# EAGLE design OpenProg-18F2550-etch (EAGLE 7.2.0)
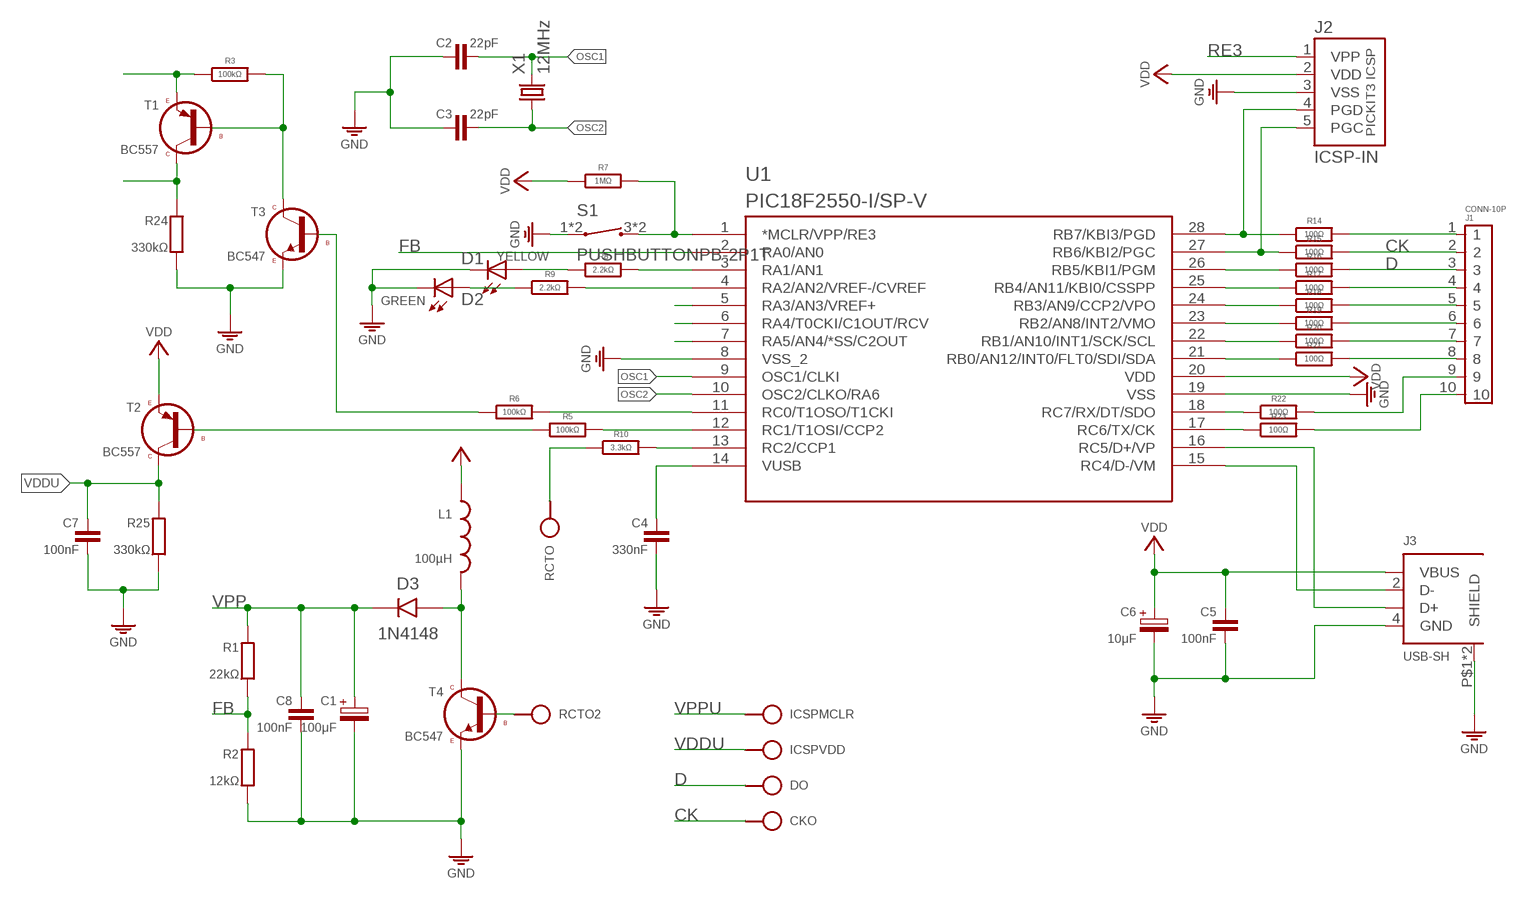
[diagram p0: schematic, sheet 1]

## Parts
C1  100μF  CPOLE2,5-5/V  [E2,5-5/V]
C2  22pF  C-H025-015X024  [C025-015X024]
C3  22pF  C-H025-015X024  [C025-015X024]
C4  330nF  C050-030X075  [C050-030X075]
C5  100nF  C025-015X024  [C025-015X024]
C6  10μF  CPOLE2.5-5  [E2,5-5]
C7  100nF  C025-015X024  [C025-015X024]
C8  100nF  C025-015X024  [C025-015X024]
CKO  HPORT  [SPAD]
D1  YELLOW  LED-3MM  [LED_3MM]
D2  GREEN  LED-3MM  [LED_3MM]
D3  1N4148  1N4148-HDO34-7  [DO34-7]
DO  HPORT  [SPAD]
ICSPMCLR  HPORT  [SPAD]
ICSPVDD  HPORT  [SPAD]
J1  CONN-10P  [CONN-10P]
J2  ICSP-IN  PICKIT3-ICSP-PK3  [PIC-PK3]
J3  USB-SH  [USB-B-PRINT]
L1  100µH  L02/10  [L-03/10V]
R1  22kΩ  R0204/10-V  [0204/10-V]
R2  12kΩ  R0204/10-V  [0204/10-V]
R3  100kΩ  R-H0204/2  [0204/2]
R5  100kΩ  R-H0204/10  [0204/10]
R6  100kΩ  R-H0204/10  [0204/10]
R7  1MΩ  R-H0204/10-V  [0204/10-V]
R8  2.2kΩ  R-H0204/10  [0204/10]
R9  2.2kΩ  R-H0204/10  [0204/10]
R10  3.3kΩ  R-H0204/10  [0204/10]
R14  100Ω  R-H0204/10  [0204/10]
R15  100Ω  R-H0204/10  [0204/10]
R16  100Ω  R-H0204/10  [0204/10]
R17  100Ω  R-H0204/10  [0204/10]
R18  100Ω  R-H0204/10  [0204/10]
R19  100Ω  R-H0204/10  [0204/10]
R20  100Ω  R-H0204/10  [0204/10]
R21  100Ω  R-H0204/10  [0204/10]
R22  100Ω  R-H0204/10  [0204/10]
R23  100Ω  R-H0204/10  [0204/10]
R24  330kΩ  R0204/10-V  [0204/10-V]
R25  330kΩ  R0204/10-V  [0204/10-V]
RCTO  HPORT  [SPAD]
RCTO2  HPORT  [SPAD]
S1  PUSHBUTTONPB-2P1T  [PB-2P1T]
T1  BC557  BC557CBE  [TO92-CBE]
T2  BC557  BC557CBE  [TO92-CBE]
T3  BC547  [TO92]
T4  BC547  [TO92]
U1  PIC18F2550-I/SP-V  [DIL28-3/V]
X1  12MHz  CRYSTALHC49  [HC49]

## Nets
CK: CKO.1 J1.2 R15.2
D: DO.1 J1.3 R16.2
FB: R1.2 R2.1 U1.2(RA0/AN0)
GND: C1.- C2.1 C3.1 C4.2 C5.2 C6.- C7.2 C8.2 D1.K(C) D2.K(C) J2.3(VSS) J3.4(GND) J3.P$1(SHIELD) J3.P$2(SHIELD) R2.2 R24.2 R25.2 S1.1 S1.2 T3.3(E) T4.3(E) U1.8(VSS_2) U1.19(VSS)
N$1: R5.1 T2.2(B)
N$3: U1.5(RA3/AN3/VREF+)
N$4: U1.6(RA4/T0CKI/C1OUT/RCV)
N$5: D3.A L1.2 T4.1(C)
N$6: U1.7(RA5/AN4/*SS/C2OUT)
N$8: R10.1 RCTO.1
N$11: R3.2 T1.2(B) T3.1(C)
N$13: J2.4(PGD) R14.1 U1.28(RB7/KBI3/PGD)
N$15: J2.5(PGC) R15.1 U1.27(RB6/KBI2/PGC)
N$16: R16.1 U1.26(RB5/KBI1/PGM)
N$17: R17.1 U1.25(RB4/AN11/KBI0/CSSPP)
N$18: R18.1 U1.24(RB3/AN9/CCP2/VPO)
N$19: R19.1 U1.23(RB2/AN8/INT2/VMO)
N$20: R20.1 U1.22(RB1/AN10/INT1/SCK/SCL)
N$21: R21.1 U1.21(RB0/AN12/INT0/FLT0/SDI/SDA)
N$22: J1.1 R14.2
N$25: J1.4 R17.2
N$26: J1.5 R18.2
N$27: J1.6 R19.2
N$28: J1.7 R20.2
N$30: R22.1 U1.18(RC7/RX/DT/SDO)
N$31: R23.1 U1.17(RC6/TX/CK)
N$32: J1.9 R22.2
N$33: J1.10 R23.2
N$34: J3.3(D+) U1.16(RC5/D+/VP)
N$36: C4.1 U1.14(VUSB)
N$39: D1.A R8.1
N$40: D2.A R9.1
OSC1: C2.2 U1.9(OSC1/CLKI) X1.2
OSC2: C3.2 U1.10(OSC2/CLKO/RA6) X1.1
RA1: R8.2 U1.3(RA1/AN1)
RA2: R9.2 U1.4(RA2/AN2/VREF-/CVREF)
RC0: R6.2 U1.11(RC0/T1OSO/T1CKI)
RC1: R5.2 U1.12(RC1/T1OSI/CCP2)
RC2: R10.2 U1.13(RC2/CCP1)
RE3: J2.1(VPP) R7.2 S1.3 S1.4 U1.1(*MCLR/VPP/RE3)
VCC: C5.1 C6.+ J2.2(VDD) J3.1(VBUS) L1.1 R7.1 T2.3(E) U1.20(VDD) ; supply symbol labelled VDD
VDD1: J1.8 R21.2
VDD3: J3.2(D-) U1.15(RC4/D-/VM)
VDDU: C7.1 ICSPVDD.1 R25.1 T2.1(C)
VPP: C1.+ C8.1 D3.C R1.1 R3.1 T1.3(E)
VPPCTL: R6.1 T3.2(B)
VPPU: ICSPMCLR.1 R24.1 T1.1(C)
VREGCTL: RCTO2.1 T4.2(B)

## Library data of the parts
C1 C6 = c:CPOL: POLARIZED CAPACITOR, European symbol
C2 C3 = c:C-H
C4 C5 C7 C8 = c:C: CAPACITOR, European symbol
CKO DO ICSPMCLR ICSPVDD RCTO RCTO2 = pad:HPORT: Conrad Connectors Created by librarian@cadsoft.de
D1 D2 = d:LED
D3 = d:1N4148-H
J1 = pinconn:CONN-10P
J2 = pinconn:PICKIT3-ICSP
J3 = usb:USB-SH
L1 = l:L: Potentiometers Beckman, Copal, Piher, Spectrol, Schukat Created by librarian@cadsoft.de
R1 R2 R24 R25 = r:R: RESISTOR, European symbol
R3 R5-R10 R14-R23 = r:R-H
S1 = sw:PUSHBUTTON
T1 T2 = t:BC557
T3 T4 = t:BC547
U1 = mcu:PIC18F2550-I/SP
X1 = q:CRYSTAL

## Net classes
0 default: width 0.406 mm

## Board
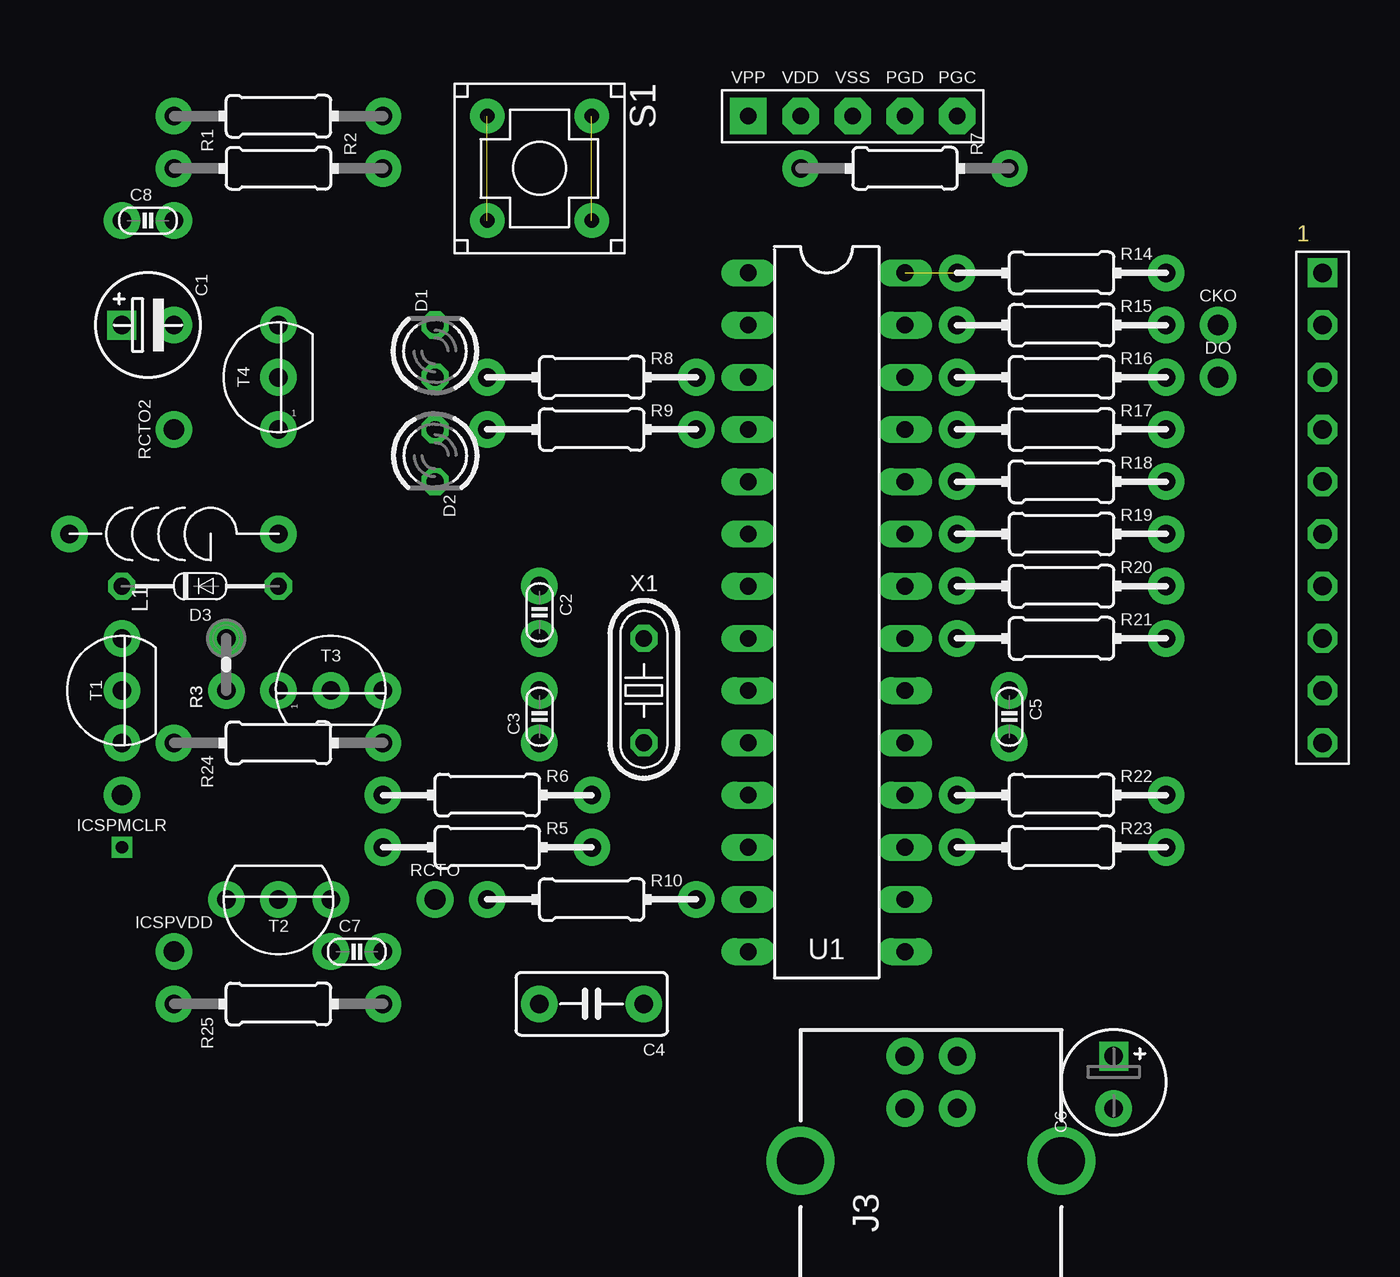
[diagram p1: board, top side]
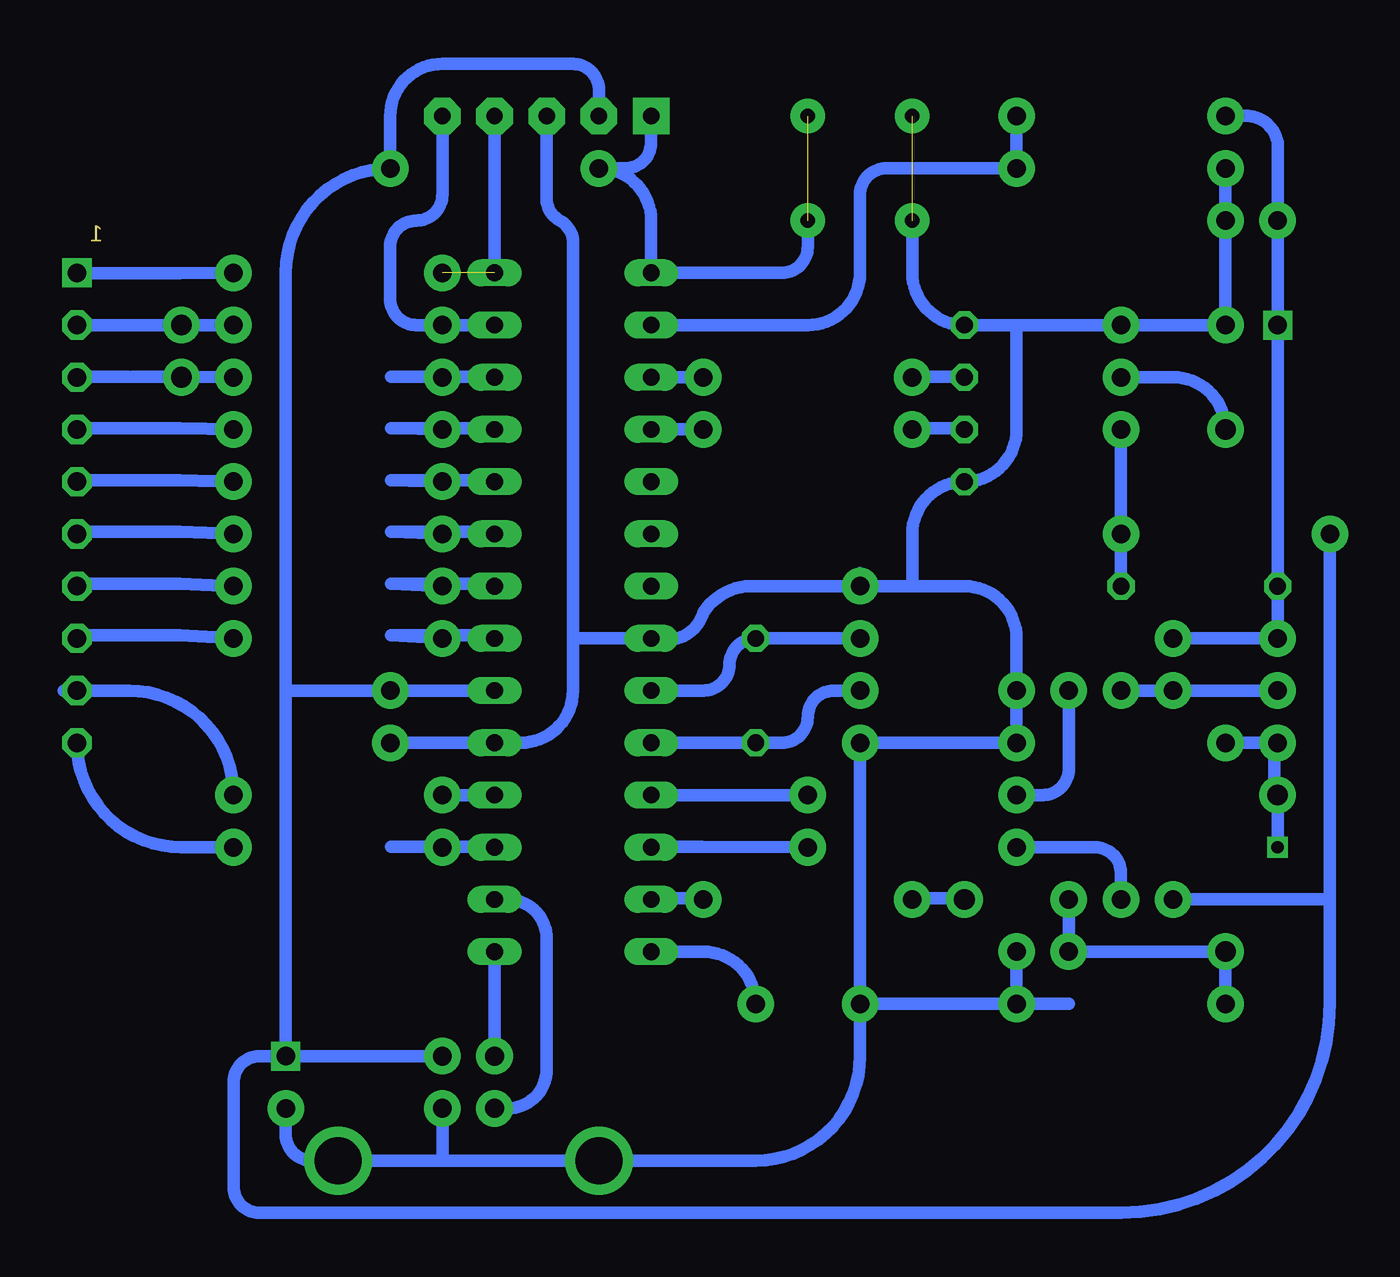
[diagram p2: board, bottom side, seen from below]

No outline drawn. Coordinates in mm, seen from the top.
Copper layers (1*16): Top 0.035mm / dielectric 1.5mm / Bottom 0.035mm
Design rules "default": minimum track width 10mil, minimum drill 24mil, track to track 8mil, track to pad 8mil, pad to pad 8mil, via to via 8mil, smd to smd 8mil, copper to edge 40mil, drill to drill 8mil, minimum pad ring 10mil, minimum via ring 8mil, stop-mask expansion 4mil, vias tented up to drill 0mil, thermal gap 10mil

### Footprints (pad centres in the part's own frame; a part is rotated, then mirrored left to right if it is on the bottom)
E2,5-5/V = drill 0.9 square: + 0,-1.27 | drill 0.9 pad 1.778: - 0,1.27
C025-015X024 = drill 0.9 pad 1.778: 1 -1.27,0; 2 1.27,0
C050-030X075 = drill 0.9 pad 1.778: 1 -2.54,0; 2 2.54,0
E2,5-5 = drill 0.9 square: + 1.27,0 | drill 0.9 pad 1.778: - -1.27,0
SPAD = drill 1 pad 1.778: 1 0,0
LED_3MM = drill 0.813 octagon: A -1.27,0; K 1.27,0
DO34-7 = drill 0.813 octagon: A -3.81,0; C 3.81,0
CONN-10P = drill 0.9 pad 1.422 square: 1 -10.16,0 | drill 0.9 pad 1.422 octagon: 2 -7.62,0; 3 -5.08,0; 4 -2.54,0; 5 0,0; 6 2.54,0; 7 5.08,0; 8 7.62,0; 9 10.16,0; 10 12.7,0
PIC-PK3 = drill 0.8 pad 1.778 square: 1 -5.08,0 | drill 0.8 pad 1.778 octagon: 2 -2.54,0; 3 0,0; 4 2.54,0; 5 5.08,0
USB-B-PRINT = drill 0.914 pad 1.778: 1 0,6.35; 2 -2.54,6.35; 3 -2.54,3.81; 4 0,3.81 | drill 2.286: P$1 5.08,1.27; P$2 -7.62,1.27
L-03/10V = drill 0.9 pad 1.778: 1 0,5.08; 2 0,-5.08
0204/10-V = drill 0.9 pad 1.778: 1 0,5.08; 2 0,-5.08
0204/2 = drill 0.9 pad 1.778: 1 1.27,0; 2 -1.27,0
0204/10 = drill 0.9 pad 1.778: 1 -5.08,0; 2 5.08,0
PB-2P1T = drill 0.7 pad 1.676: 1 2.54,-2.54; 2 -2.54,-2.54; 3 2.54,2.54; 4 -2.54,2.54
TO92-CBE = drill 0.9 pad 1.778: 1 0,2.54; 2 0,0; 3 0,-2.54
TO92 = drill 0.9 pad 1.778: 1 0,2.54; 2 0,0; 3 0,-2.54
DIL28-3/V = drill 0.813 long: 1 -3.81,16.51; 2 -3.81,13.97; 3 -3.81,11.43; 4 -3.81,8.89; 5 -3.81,6.35; 6 -3.81,3.81; 7 -3.81,1.27; 8 -3.81,-1.27; 9 -3.81,-3.81; 10 -3.81,-6.35; 11 -3.81,-8.89; 12 -3.81,-11.43; 13 -3.81,-13.97; 14 -3.81,-16.51; 15 3.81,-16.51; 16 3.81,-13.97; 17 3.81,-11.43; 18 3.81,-8.89; 19 3.81,-6.35; 20 3.81,-3.81; 21 3.81,-1.27; 22 3.81,1.27; 23 3.81,3.81; 24 3.81,6.35; 25 3.81,8.89; 26 3.81,11.43; 27 3.81,13.97; 28 3.81,16.51
HC49 = drill 0.813 octagon: 1 0,-2.54; 2 0,2.54

### Placement (x,y rotation side)
C1  8.89,45.72 270 top
C2  27.94,31.75 270 top
C3  27.94,26.67 90 top
C4  30.48,12.7 180 top
C5  50.8,26.67 270 top
C6  55.88,8.89 90 top
C7  19.05,15.24 0 top
C8  8.89,50.8 0 top
CKO  60.96,45.72 270 top
D1  22.86,44.45 90 top
D2  22.86,39.37 270 top
D3  11.43,33.02 180 top
DO  60.96,43.18 270 top
ICSPMCLR  7.62,22.86 90 top
ICSPVDD  10.16,15.24 270 top
J1  66.04,38.1 270 top
J2  43.18,55.88 0 top
J3  48.26,3.81 0 top
L1  10.16,35.56 90 top
R1  15.24,55.88 90 top
R2  15.24,53.34 270 top
R3  12.7,29.21 90 top
R5  25.4,20.32 0 top
R6  25.4,22.86 0 top
R7  45.72,53.34 270 top
R8  30.48,43.18 0 top
R9  30.48,40.64 0 top
R10  30.48,17.78 0 top
R14  53.34,48.26 0 top
R15  53.34,45.72 0 top
R16  53.34,43.18 0 top
R17  53.34,40.64 0 top
R18  53.34,38.1 0 top
R19  53.34,35.56 0 top
R20  53.34,33.02 0 top
R21  53.34,30.48 0 top
R22  53.34,22.86 0 top
R23  53.34,20.32 0 top
R24  15.24,25.4 90 top
R25  15.24,12.7 90 top
RCTO  22.86,17.78 270 top
RCTO2  10.16,40.64 0 top
S1  27.94,53.34 270 top
T1  7.62,27.94 180 top
T2  15.24,17.78 270 top
T3  17.78,27.94 90 top
T4  15.24,43.18 180 top
U1  41.91,31.75 0 top
X1  33.02,27.94 0 top

### Tracks (layer width: path | path; a pad name or v marks a point on that pad's centre or on a via)
CK
  Bottom 0.61: J1.2 CKO.1 R15.2
D
  Bottom 0.61: J1.3 65.84,43.2 63.55,43.2 DO.1 63.32,43.2 61.04,43.2 R16.2
FB
  Bottom 0.61: R2.1 R1.2 20.32,53.98 arc90 20.95,53.34 26.67,53.34 arc-90 27.94,52.07 27.94,48.26 arc90 30.48,45.72 U1.2
GND  (1 unrouted)
  Bottom 0.61: C5.2 U1.19 44.45,25.4 arc-90 41.91,27.94 41.91,30.48 | 41.91,30.48 U1.8 36.83,30.48 arc-60 35.56,31.75 arc60 33.02,33.02 28.57,33.02 | 41.91,30.48 41.91,49.53 arc-70 42.55,50.8 arc70 43.18,52.07 J2.3 | 48.26,5.08 J3.P$1 54.61,5.08 arc90 55.88,6.35 C6.- | 48.26,5.08 J3.4 | 28.57,33.02 C2.1 25.4,33.02 | C4.2 C3.1 R24.2 T3.3 20.32,30.48 arc-90 22.86,33.02 25.4,33.02 | R25.2 C7.2 | C8.2 C1.- | C1.- R2.2 | C1.- T4.3 20.32,45.72 | C4.2 R25.2 | R25.2 17.78,12.7 | C4.2 27.94,10.16 arc90 33.02,5.08 J3.P$2 48.26,5.08 | 27.94,33.66 arc90 28.57,33.02 | S1.1 25.4,48.26 arc-90 D1.K 20.32,45.72 | 25.4,33.02 25.4,35.56 arc90 D2.K arc-90 20.32,40.64 20.32,45.72
N$1
  Bottom 0.61: R5.1 16.51,20.32 arc90 15.24,19.05 T2.2
N$5
  Bottom 0.61: L1.2 D3.A T4.1
N$8
  Bottom 0.61: RCTO.1 22.86,17.83 25.38,17.83 R10.1
N$11
  Bottom 0.61: T1.2 R3.2 T3.1
N$13  (1 unrouted)
  Bottom 0.61: J2.4 U1.28
N$15
  Bottom 0.61: U1.27 R15.1 49.53,45.72 arc90 50.8,46.99 50.8,49.53 arc90 49.53,50.8 arc-90 48.26,52.07 J2.5
N$16
  Bottom 0.61: U1.26 45.72,43.2 50.75,43.2 R16.1
N$17
  Bottom 0.61: U1.25 45.72,40.69 50.75,40.69 R17.1
N$18
  Bottom 0.61: U1.24 45.72,38.18 50.75,38.18 R18.1
N$19
  Bottom 0.61: U1.23 45.72,35.66 50.75,35.66 R19.1
N$20
  Bottom 0.61: U1.22 45.72,33.15 50.75,33.15 R20.1
N$21
  Bottom 0.61: U1.21 45.72,30.63 50.75,30.63 R21.1
N$22
  Bottom 0.61: J1.1 65.84,48.23 61.04,48.23 R14.2
N$25
  Bottom 0.61: J1.4 65.84,40.69 61.04,40.69 R17.2
N$26
  Bottom 0.61: J1.5 65.84,38.18 61.04,38.18 R18.2
N$27
  Bottom 0.61: J1.6 65.84,35.66 61.04,35.66 R19.2
N$28
  Bottom 0.61: J1.7 65.84,33.15 61.04,33.15 R20.2
N$30
  Bottom 0.61: R22.1 U1.18
N$31
  Bottom 0.61: U1.17 45.72,20.34 50.75,20.34 R23.1
N$32
  Bottom 0.61: R22.2 arc-90 63.5,27.94 J1.9 66.67,27.94
N$33
  Bottom 0.61: R23.2 60.96,20.32 arc90 J1.10
N$34
  Bottom 0.61: J3.3 45.09,7.62 arc-90 43.18,9.53 43.18,15.88 arc-90 45.09,17.78 U1.16
N$36
  Bottom 0.61: C4.1 arc-90 35.56,15.24 U1.14
N$39
  Bottom 0.61: D1.A 22.86,43.2 25.38,43.2 R8.1
N$40
  Bottom 0.61: D2.A 22.86,40.69 25.38,40.69 R9.1
OSC1
  Bottom 0.61: C2.2 X1.2 arc-90 34.29,29.21 arc90 35.56,27.94 U1.9
OSC2
  Bottom 0.61: U1.10 X1.1 31.75,25.4 arc-90 30.48,26.67 arc90 29.21,27.94 C3.2
RA1
  Bottom 0.61: U1.3 R8.2
RA2
  Bottom 0.61: U1.4 R9.2
RC0
  Bottom 0.61: R6.2 U1.11
RC1
  Bottom 0.61: U1.12 37.95,20.34 35.66,20.34 R5.2
RC2
  Bottom 0.61: U1.13 37.95,17.83 35.66,17.83 R10.2
RE3  (1 unrouted)
  Bottom 0.61: S1.3 30.48,49.53 arc90 31.75,48.26 U1.1 38.1,50.8 arc-90 R7.2 39.37,53.34 arc-90 38.1,54.61 J2.1
VCC
  Bottom 0.61: U1.20 C5.1 55.88,27.94 | J2.2 40.64,57.15 arc-90 41.91,58.42 48.26,58.42 arc-90 50.8,55.88 R7.1 arc-90 55.88,48.26 55.88,27.94 | L1.1 5.08,17.78 | 5.08,17.78 5.08,12.7 arc90 15.24,2.54 57.15,2.54 arc90 58.42,3.81 58.42,8.89 arc90 57.15,10.16 C6.+ | T2.3 5.08,17.78 | J3.1 C6.+ | C6.+ 55.88,27.94
VDD1
  Bottom 0.61: J1.8 65.84,30.63 61.04,30.63 R21.2
VDD3
  Bottom 0.61: J3.2 U1.15
VDDU
  Bottom 0.61: T2.1 C7.1 ICSPVDD.1 R25.1
VPP
  Bottom 0.61: C1.+ D3.C T1.3 R3.1 | C8.1 C1.+ | C1.+ 7.62,54.61 arc-90 9.53,55.88 R1.1
VPPCTL
  Bottom 0.61: T3.2 17.78,24.13 arc90 19.05,22.86 R6.1
VPPU  (via drill 0.6)
  Bottom 0.61: R24.1 T1.1 7.77,25.38 7.77,22.86 ICSPMCLR.1 v7.62,20.32
VREGCTL
  Bottom 0.61: T4.2 12.7,43.18 arc90 RCTO2.1

### Text on the board
Document: 7 | 6 | 5 | 4 | 3 | 2 | 1 | 10 | 9 | 8 | 7 | 6 | 5 | 4 | 3 | 2 | 1 | 10 | 9 | 8 | 7 | 6 | 5 | 4 | 3 | 2 | 1 | 1 | 2 | 3 | 4 | 5 | 6 | 7 | 8 | 9 | 10 | 1 | 2 | 3 | 4 | 5 | 6 | 7 | 8 | 9 | 10 | 1 | 2 | 3